# Altium schematic sheet cyc_v_som_B.SchDoc
size A3
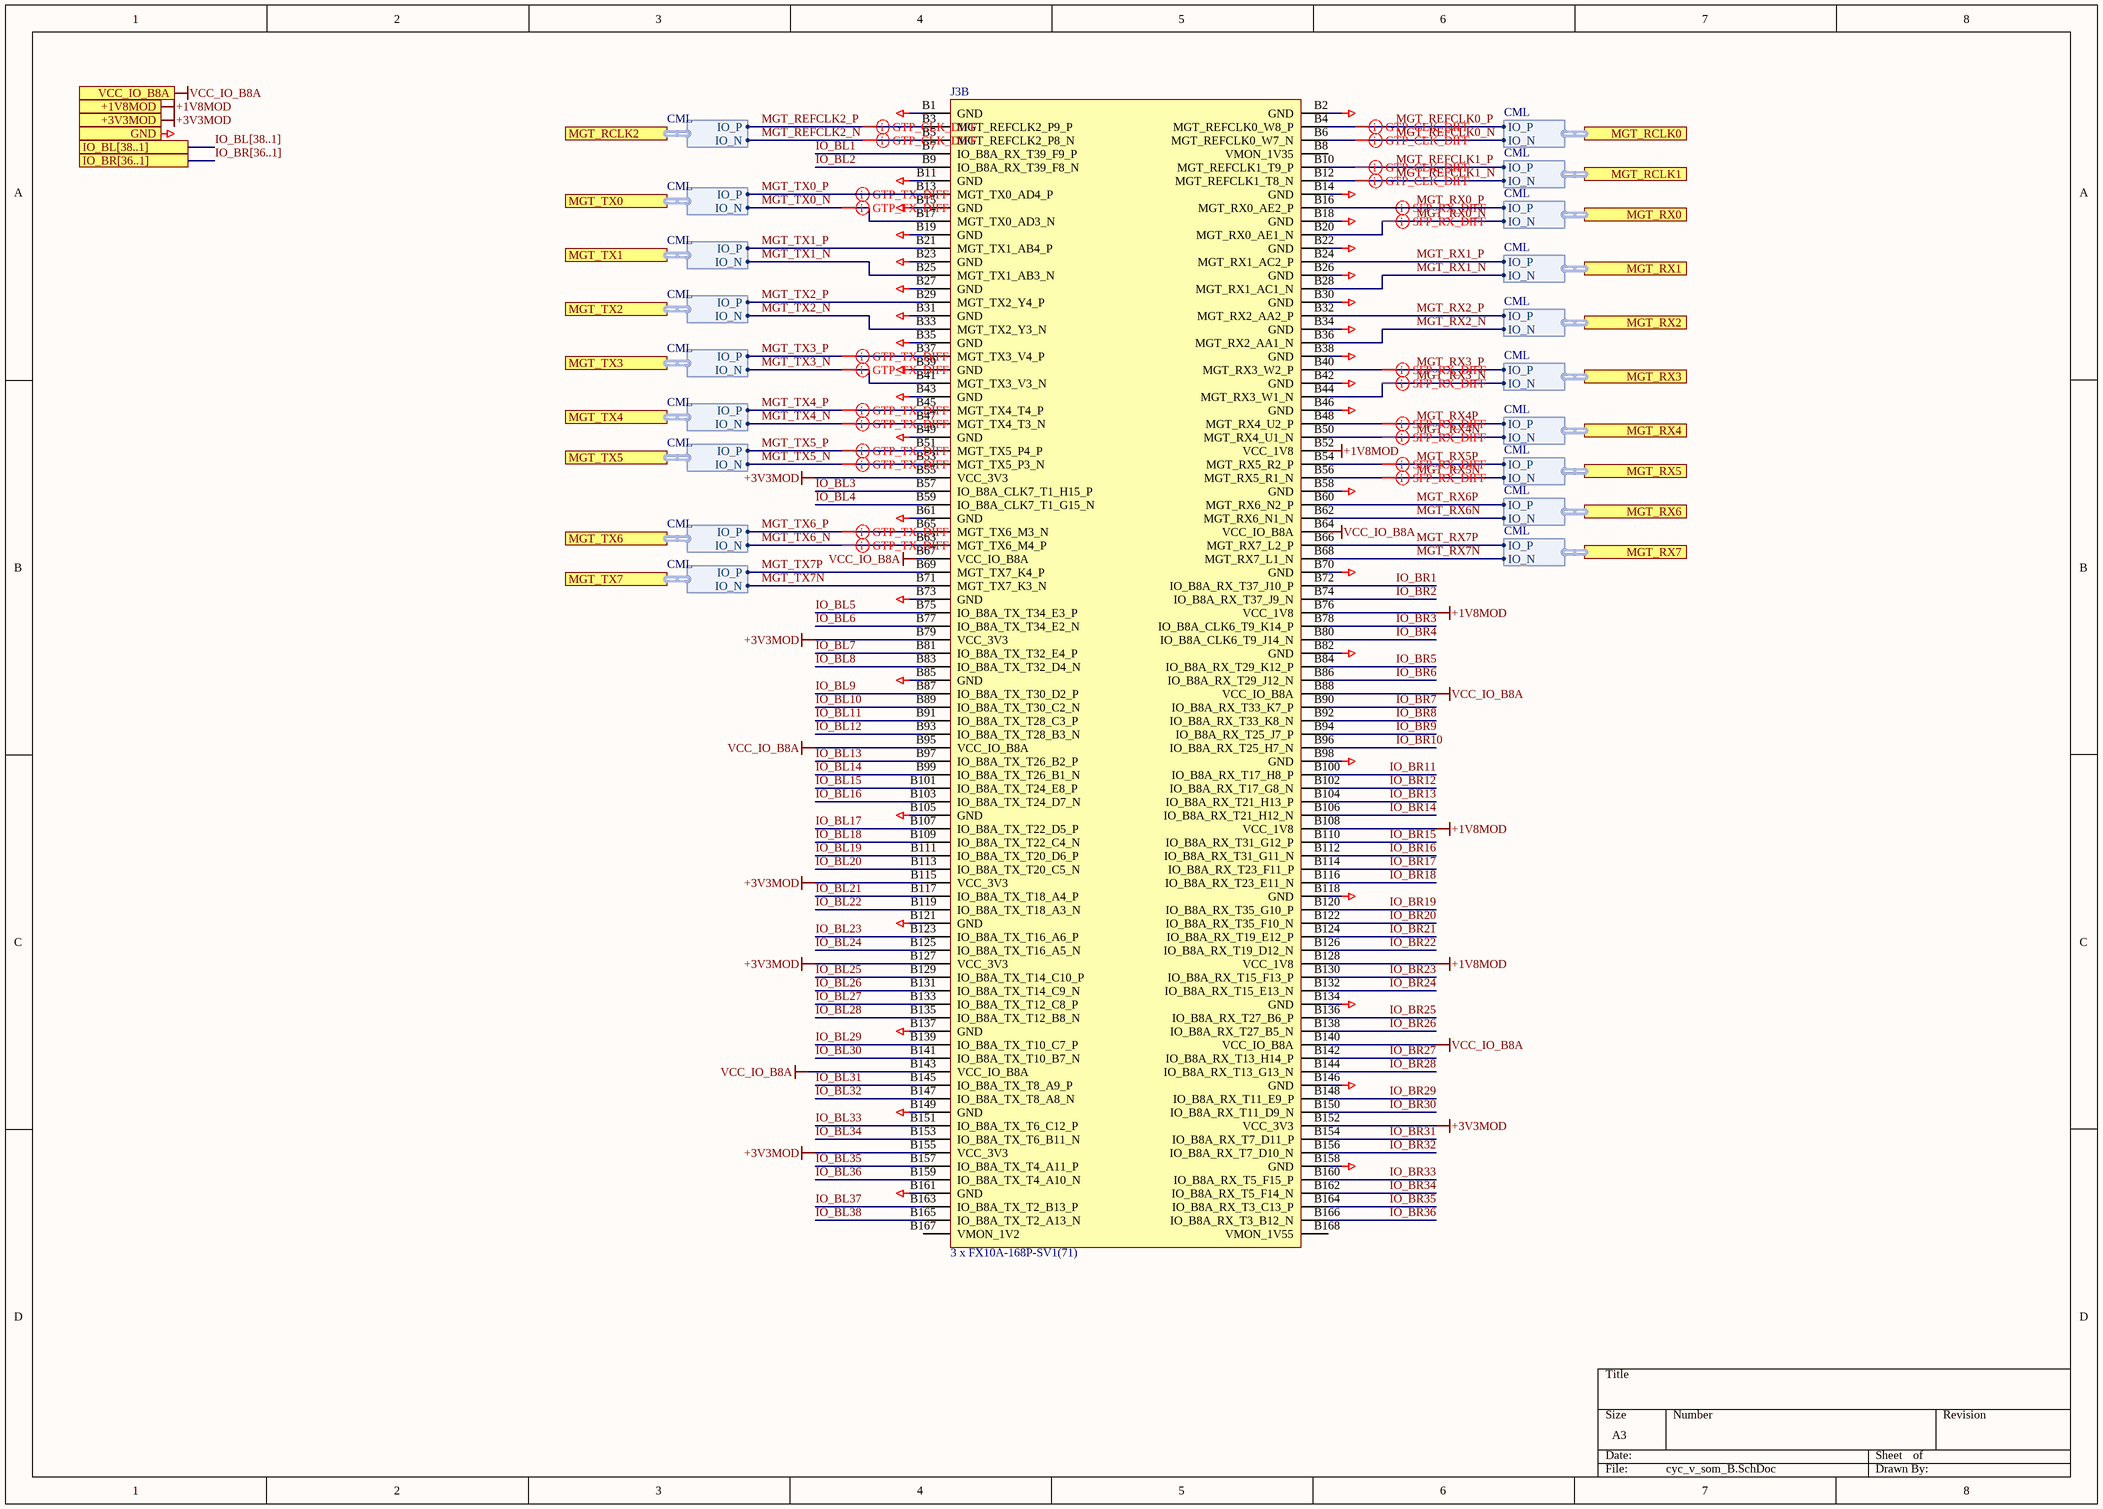
[diagram p0: cyc_v_som_B.SchDoc]

## Parts
J3  3 x FX10A-168P-SV1(71)  [Mercury_SA2p]  (part B of 4)

## Ports
+1V8MOD, +3V3MOD, GND, IO_BL[38..1], IO_BR[36..1], MGT_RCLK0 (harness CML), MGT_RCLK1 (harness CML), MGT_RCLK2 (harness CML), MGT_RX0 (harness CML), MGT_RX1 (harness CML), MGT_RX2 (harness CML), MGT_RX3 (harness CML), MGT_RX4 (harness CML), MGT_RX5 (harness CML), MGT_RX6 (harness CML), MGT_RX7 (harness CML), MGT_TX0 (harness CML), MGT_TX1 (harness CML), MGT_TX2 (harness CML), MGT_TX3 (harness CML), MGT_TX4 (harness CML), MGT_TX5 (harness CML), MGT_TX6 (harness CML), MGT_TX7 (harness CML), VCC_IO_B8A

## Harnesses
CML: IO_N, IO_P

## Nets
+1V8MOD: J3.B52(VCC_1V8) J3.B76(VCC_1V8) J3.B108(VCC_1V8) J3.B128(VCC_1V8) ; port +1V8MOD
+3V3MOD: J3.B55(VCC_3V3) J3.B79(VCC_3V3) J3.B115(VCC_3V3) J3.B127(VCC_3V3) J3.B152(VCC_3V3) J3.B155(VCC_3V3) ; port +3V3MOD
GND: J3.B1(GND) J3.B2(GND) J3.B11(GND) J3.B14(GND) J3.B15(GND) J3.B18(GND) J3.B19(GND) J3.B22(GND) J3.B23(GND) J3.B26(GND) J3.B27(GND) J3.B30(GND) J3.B31(GND) J3.B34(GND) J3.B35(GND) J3.B38(GND) J3.B39(GND) J3.B42(GND) J3.B43(GND) J3.B46(GND) J3.B49(GND) J3.B58(GND) J3.B61(GND) J3.B70(GND) J3.B73(GND) J3.B82(GND) J3.B85(GND) J3.B98(GND) J3.B105(GND) J3.B118(GND) J3.B121(GND) J3.B134(GND) J3.B137(GND) J3.B146(GND) J3.B149(GND) J3.B158(GND) J3.B161(GND) ; port GND
VCC_IO_B8A: J3.B64(VCC_IO_B8A) J3.B67(VCC_IO_B8A) J3.B88(VCC_IO_B8A) J3.B95(VCC_IO_B8A) J3.B140(VCC_IO_B8A) J3.B143(VCC_IO_B8A) ; port VCC_IO_B8A
IO_BL1: J3.B7(IO_B8A_RX_T39_F9_P)
IO_BL2: J3.B9(IO_B8A_RX_T39_F8_N)
IO_BL3: J3.B57(IO_B8A_CLK7_T1_H15_P)
IO_BL4: J3.B59(IO_B8A_CLK7_T1_G15_N)
IO_BL5: J3.B75(IO_B8A_TX_T34_E3_P)
IO_BL6: J3.B77(IO_B8A_TX_T34_E2_N)
IO_BL7: J3.B81(IO_B8A_TX_T32_E4_P)
IO_BL8: J3.B83(IO_B8A_TX_T32_D4_N)
IO_BL9: J3.B87(IO_B8A_TX_T30_D2_P)
IO_BL10: J3.B89(IO_B8A_TX_T30_C2_N)
IO_BL11: J3.B91(IO_B8A_TX_T28_C3_P)
IO_BL12: J3.B93(IO_B8A_TX_T28_B3_N)
IO_BL13: J3.B97(IO_B8A_TX_T26_B2_P)
IO_BL14: J3.B99(IO_B8A_TX_T26_B1_N)
IO_BL15: J3.B101(IO_B8A_TX_T24_E8_P)
IO_BL16: J3.B103(IO_B8A_TX_T24_D7_N)
IO_BL17: J3.B107(IO_B8A_TX_T22_D5_P)
IO_BL18: J3.B109(IO_B8A_TX_T22_C4_N)
IO_BL19: J3.B111(IO_B8A_TX_T20_D6_P)
IO_BL20: J3.B113(IO_B8A_TX_T20_C5_N)
IO_BL21: J3.B117(IO_B8A_TX_T18_A4_P)
IO_BL22: J3.B119(IO_B8A_TX_T18_A3_N)
IO_BL23: J3.B123(IO_B8A_TX_T16_A6_P)
IO_BL24: J3.B125(IO_B8A_TX_T16_A5_N)
IO_BL25: J3.B129(IO_B8A_TX_T14_C10_P)
IO_BL26: J3.B131(IO_B8A_TX_T14_C9_N)
IO_BL27: J3.B133(IO_B8A_TX_T12_C8_P)
IO_BL28: J3.B135(IO_B8A_TX_T12_B8_N)
IO_BL29: J3.B139(IO_B8A_TX_T10_C7_P)
IO_BL30: J3.B141(IO_B8A_TX_T10_B7_N)
IO_BL31: J3.B145(IO_B8A_TX_T8_A9_P)
IO_BL32: J3.B147(IO_B8A_TX_T8_A8_N)
IO_BL33: J3.B151(IO_B8A_TX_T6_C12_P)
IO_BL34: J3.B153(IO_B8A_TX_T6_B11_N)
IO_BL35: J3.B157(IO_B8A_TX_T4_A11_P)
IO_BL36: J3.B159(IO_B8A_TX_T4_A10_N)
IO_BL37: J3.B163(IO_B8A_TX_T2_B13_P)
IO_BL38: J3.B165(IO_B8A_TX_T2_A13_N)
IO_BR1: J3.B72(IO_B8A_RX_T37_J10_P)
IO_BR2: J3.B74(IO_B8A_RX_T37_J9_N)
IO_BR3: J3.B78(IO_B8A_CLK6_T9_K14_P)
IO_BR4: J3.B80(IO_B8A_CLK6_T9_J14_N)
IO_BR5: J3.B84(IO_B8A_RX_T29_K12_P)
IO_BR6: J3.B86(IO_B8A_RX_T29_J12_N)
IO_BR7: J3.B90(IO_B8A_RX_T33_K7_P)
IO_BR8: J3.B92(IO_B8A_RX_T33_K8_N)
IO_BR9: J3.B94(IO_B8A_RX_T25_J7_P)
IO_BR10: J3.B96(IO_B8A_RX_T25_H7_N)
IO_BR11: J3.B100(IO_B8A_RX_T17_H8_P)
IO_BR12: J3.B102(IO_B8A_RX_T17_G8_N)
IO_BR13: J3.B104(IO_B8A_RX_T21_H13_P)
IO_BR14: J3.B106(IO_B8A_RX_T21_H12_N)
IO_BR15: J3.B110(IO_B8A_RX_T31_G12_P)
IO_BR16: J3.B112(IO_B8A_RX_T31_G11_N)
IO_BR17: J3.B114(IO_B8A_RX_T23_F11_P)
IO_BR18: J3.B116(IO_B8A_RX_T23_E11_N)
IO_BR19: J3.B120(IO_B8A_RX_T35_G10_P)
IO_BR20: J3.B122(IO_B8A_RX_T35_F10_N)
IO_BR21: J3.B124(IO_B8A_RX_T19_E12_P)
IO_BR22: J3.B126(IO_B8A_RX_T19_D12_N)
IO_BR23: J3.B130(IO_B8A_RX_T15_F13_P)
IO_BR24: J3.B132(IO_B8A_RX_T15_E13_N)
IO_BR25: J3.B136(IO_B8A_RX_T27_B6_P)
IO_BR26: J3.B138(IO_B8A_RX_T27_B5_N)
IO_BR27: J3.B142(IO_B8A_RX_T13_H14_P)
IO_BR28: J3.B144(IO_B8A_RX_T13_G13_N)
IO_BR29: J3.B148(IO_B8A_RX_T11_E9_P)
IO_BR30: J3.B150(IO_B8A_RX_T11_D9_N)
IO_BR31: J3.B154(IO_B8A_RX_T7_D11_P)
IO_BR32: J3.B156(IO_B8A_RX_T7_D10_N)
IO_BR33: J3.B160(IO_B8A_RX_T5_F15_P)
IO_BR34: J3.B162(IO_B8A_RX_T5_F14_N)
IO_BR35: J3.B164(IO_B8A_RX_T3_C13_P)
IO_BR36: J3.B166(IO_B8A_RX_T3_B12_N)
MGT_REFCLK0_N: J3.B6(MGT_REFCLK0_W7_N) ; port MGT_RCLK0.IO_N
MGT_REFCLK0_P: J3.B4(MGT_REFCLK0_W8_P) ; port MGT_RCLK0.IO_P
MGT_REFCLK1_N: J3.B12(MGT_REFCLK1_T8_N) ; port MGT_RCLK1.IO_N
MGT_REFCLK1_P: J3.B10(MGT_REFCLK1_T9_P) ; port MGT_RCLK1.IO_P
MGT_REFCLK2_N: J3.B5(MGT_REFCLK2_P8_N) ; port MGT_RCLK2.IO_N
MGT_REFCLK2_P: J3.B3(MGT_REFCLK2_P9_P) ; port MGT_RCLK2.IO_P
MGT_RX0_N: J3.B20(MGT_RX0_AE1_N) ; port MGT_RX0.IO_N
MGT_RX0_P: J3.B16(MGT_RX0_AE2_P) ; port MGT_RX0.IO_P
MGT_RX1_N: J3.B28(MGT_RX1_AC1_N) ; port MGT_RX1.IO_N
MGT_RX1_P: J3.B24(MGT_RX1_AC2_P) ; port MGT_RX1.IO_P
MGT_RX2_N: J3.B36(MGT_RX2_AA1_N) ; port MGT_RX2.IO_N
MGT_RX2_P: J3.B32(MGT_RX2_AA2_P) ; port MGT_RX2.IO_P
MGT_RX3_N: J3.B44(MGT_RX3_W1_N) ; port MGT_RX3.IO_N
MGT_RX3_P: J3.B40(MGT_RX3_W2_P) ; port MGT_RX3.IO_P
MGT_RX4N: J3.B50(MGT_RX4_U1_N) ; port MGT_RX4.IO_N
MGT_RX4P: J3.B48(MGT_RX4_U2_P) ; port MGT_RX4.IO_P
MGT_RX5N: J3.B56(MGT_RX5_R1_N) ; port MGT_RX5.IO_N
MGT_RX5P: J3.B54(MGT_RX5_R2_P) ; port MGT_RX5.IO_P
MGT_RX6N: J3.B62(MGT_RX6_N1_N) ; port MGT_RX6.IO_N
MGT_RX6P: J3.B60(MGT_RX6_N2_P) ; port MGT_RX6.IO_P
MGT_RX7N: J3.B68(MGT_RX7_L1_N) ; port MGT_RX7.IO_N
MGT_RX7P: J3.B66(MGT_RX7_L2_P) ; port MGT_RX7.IO_P
MGT_TX0_N: J3.B17(MGT_TX0_AD3_N) ; port MGT_TX0.IO_N
MGT_TX0_P: J3.B13(MGT_TX0_AD4_P) ; port MGT_TX0.IO_P
MGT_TX1_N: J3.B25(MGT_TX1_AB3_N) ; port MGT_TX1.IO_N
MGT_TX1_P: J3.B21(MGT_TX1_AB4_P) ; port MGT_TX1.IO_P
MGT_TX2_N: J3.B33(MGT_TX2_Y3_N) ; port MGT_TX2.IO_N
MGT_TX2_P: J3.B29(MGT_TX2_Y4_P) ; port MGT_TX2.IO_P
MGT_TX3_N: J3.B41(MGT_TX3_V3_N) ; port MGT_TX3.IO_N
MGT_TX3_P: J3.B37(MGT_TX3_V4_P) ; port MGT_TX3.IO_P
MGT_TX4_N: J3.B47(MGT_TX4_T3_N) ; port MGT_TX4.IO_N
MGT_TX4_P: J3.B45(MGT_TX4_T4_P) ; port MGT_TX4.IO_P
MGT_TX5_N: J3.B53(MGT_TX5_P3_N) ; port MGT_TX5.IO_N
MGT_TX5_P: J3.B51(MGT_TX5_P4_P) ; port MGT_TX5.IO_P
MGT_TX6_N: J3.B63(MGT_TX6_M4_P) ; port MGT_TX6.IO_N
MGT_TX6_P: J3.B65(MGT_TX6_M3_N) ; port MGT_TX6.IO_P
MGT_TX7N: J3.B71(MGT_TX7_K3_N) ; port MGT_TX7.IO_N
MGT_TX7P: J3.B69(MGT_TX7_K4_P) ; port MGT_TX7.IO_P

Not connected (* = marked no-connect by the designer): J3 B8(VMON_1V35) B167(VMON_1V2) B168(VMON_1V55)

## Buses and harness runs
bus IO_BL[38..1] = port IO_BL[38..1]
bus IO_BR[36..1] = port IO_BR[36..1]

## Layout directives
differential pair; rule Differential Pairs Routing [Pref Gap = 0.175mm    Min Gap  = 0.075mm    Max Gap  = 0.5mmPref Width = 0.25mm    Min Width  = 0.075mm    Max Width  = 0.5mm]: MGT_REFCLK0_N, MGT_REFCLK0_P, MGT_REFCLK1_N, MGT_REFCLK1_P, MGT_REFCLK2_N, MGT_REFCLK2_P, MGT_RX0_N, MGT_RX0_P, MGT_RX3_N, MGT_RX3_P, MGT_RX4N, MGT_RX4P, MGT_RX5N, MGT_RX5P, MGT_TX0_N, MGT_TX0_P, MGT_TX3_N, MGT_TX3_P, MGT_TX4_N, MGT_TX4_P, MGT_TX5_N, MGT_TX5_P, MGT_TX6_N, MGT_TX6_P

## Library data of the parts
J3 = FX10A-168P-SV_ME-SA2+: Pin_Count: 168; SolderOption: 0; Pkg: SMD 170pin; SMD Solders: 170; HelpURL: https://www.hirose.com/product/document?clcode=CL0570-0044-8-71&productname=FX10A-168P-SV(71)&series=FX10&documenttype=Catalog&lang=ru&documentid=D31650_en; PartField: FX10A-168P-SV1(71); Value: 3 x FX10A-168P-SV1(71); THD Solders: 0